# Altium schematic sheet Sheet1.SchDoc
size A; SheetNumber: 1; SheetTotal: 1
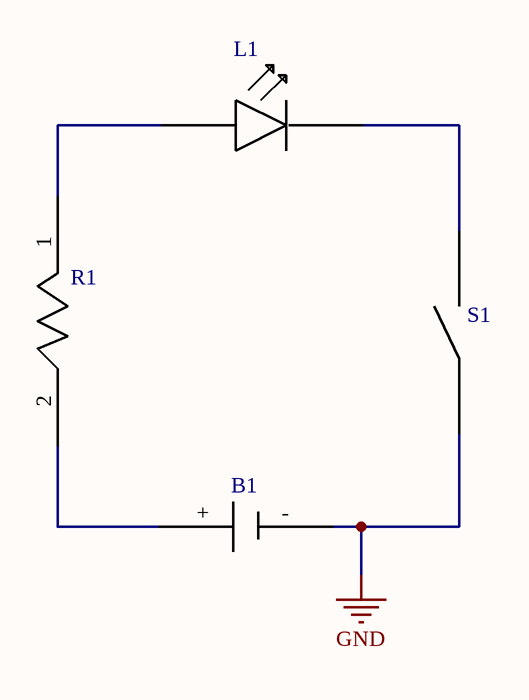
[diagram p0: Sheet1.SchDoc]

## Parts
B1  (no value)  [Battery]
L1  LED  [LED]  (value not drawn)
R1  Through Hole Res 1K  [Through Hole Res 1K]  (value not drawn)
S1  (no value)  [Switch]

## Nets
GND: B1.- S1.2
NetB1_+: B1.+ R1.2
NetL1_1: L1.1 S1.1
NetL1_2: L1.2 R1.1

## Library data of the parts
B1 = Battery
S1 = Switch: Manufacturer: Texas Insrument; Supplier: LCSC